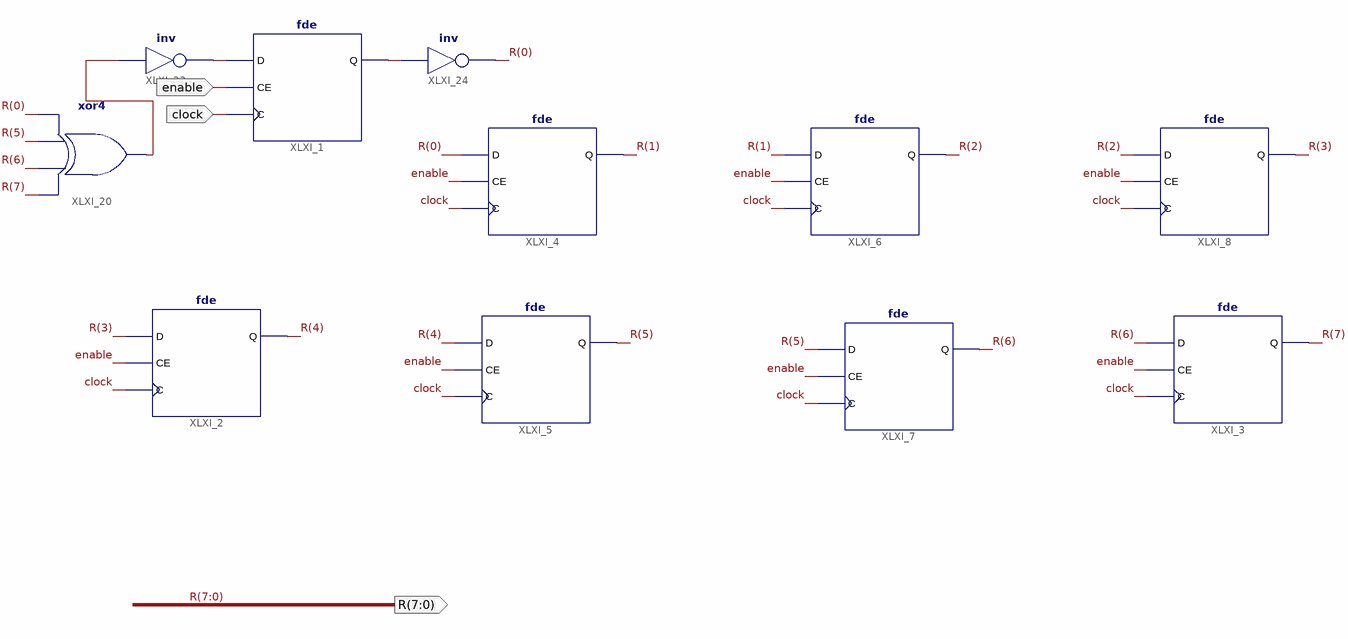
[diagram p0: schematic sheet 1]
// Xilinx ISE schematic LFSR.sch (spartan3e) as structural Verilog: 11 symbols, 3 ports
module LFSR (
  input  clock,
  input  enable,
  output [7:0] R
);

  wire XLXN_23, XLXN_24, XLXN_25;

  fde XLXI_2 (.C(clock), .CE(enable), .D(R[3]), .Q(R[4]));
  fde XLXI_4 (.C(clock), .CE(enable), .D(R[0]), .Q(R[1]));
  fde XLXI_5 (.C(clock), .CE(enable), .D(R[4]), .Q(R[5]));
  fde XLXI_8 (.C(clock), .CE(enable), .D(R[2]), .Q(R[3]));
  fde XLXI_6 (.C(clock), .CE(enable), .D(R[1]), .Q(R[2]));
  fde XLXI_3 (.C(clock), .CE(enable), .D(R[6]), .Q(R[7]));
  fde XLXI_7 (.C(clock), .CE(enable), .D(R[5]), .Q(R[6]));
  xor XLXI_20 (XLXN_25, R[7], R[6], R[5], R[0]);
  fde XLXI_1 (.C(clock), .CE(enable), .D(XLXN_23), .Q(XLXN_24));
  not XLXI_23 (XLXN_23, XLXN_25);
  not XLXI_24 (R[0], XLXN_24);
endmodule
